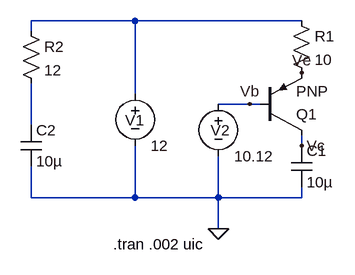
[diagram p0: schematic pnp-current-source2.asc]
pnp-current-source2.asc, the LTspice schematic file:
Version 4
SHEET 1 880 680
WIRE 16 16 -144 16
WIRE 272 16 16 16
WIRE -144 32 -144 16
WIRE 16 128 16 16
WIRE 192 144 144 144
WIRE 208 144 192 144
WIRE -144 176 -144 112
WIRE 272 208 272 192
WIRE -144 288 -144 240
WIRE 16 288 16 208
WIRE 16 288 -144 288
WIRE 144 288 144 224
WIRE 144 288 16 288
WIRE 272 288 272 272
WIRE 272 288 144 288
WIRE 144 336 144 288
FLAG 144 336 0
FLAG 272 96 Ve
FLAG 192 144 Vb
FLAG 272 208 Vc
SYMBOL voltage 16 112 R0
WINDOW 0 -15 57 Left 2
SYMATTR InstName V1
SYMATTR Value 12
SYMBOL voltage 144 128 R0
WINDOW 0 -12 56 Left 2
WINDOW 123 0 0 Left 2
WINDOW 39 0 0 Left 2
SYMATTR InstName V2
SYMATTR Value 10.12
SYMBOL res 256 0 R0
SYMATTR InstName R1
SYMATTR Value 10
SYMBOL pnp 208 192 M180
SYMATTR InstName Q1
SYMBOL cap 256 208 R0
SYMATTR InstName C1
SYMATTR Value 10µ
SYMBOL res -160 16 R0
SYMATTR InstName R2
SYMATTR Value 12
SYMBOL cap -160 176 R0
SYMATTR InstName C2
SYMATTR Value 10µ
TEXT -18 360 Left 2 !.tran .002 uic

The netlist it stands for:
* pnp-current-source2.asc
V1 N001 0 12
V2 Vb 0 10.12
R1 N001 Ve 10
Q1 Vc Vb Ve 0 PNP
C1 Vc 0 10µ
R2 N001 N002 12
C2 N002 0 10µ
.model NPN NPN
.model PNP PNP
.lib standard.bjt
.tran .002 uic
.backanno
.end